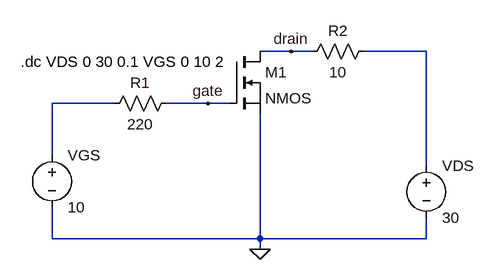
[diagram p0: schematic NMOS TRANSISTOR.asc]
NMOS TRANSISTOR.asc, the LTspice schematic file:
Version 4
SHEET 1 880 680
WIRE 320 16 272 16
WIRE 352 16 320 16
WIRE 528 16 432 16
WIRE 48 96 -48 96
WIRE 192 96 128 96
WIRE 224 96 192 96
WIRE -48 176 -48 96
WIRE 528 192 528 16
WIRE -48 304 -48 256
WIRE 272 304 272 112
WIRE 272 304 -48 304
WIRE 528 304 528 272
WIRE 528 304 272 304
WIRE 272 320 272 304
FLAG 272 320 0
FLAG 192 96 gate
FLAG 320 16 drain
SYMBOL voltage -48 160 R0
SYMATTR InstName VGS
SYMATTR Value 10
SYMBOL voltage 528 176 R0
SYMATTR InstName VDS
SYMATTR Value 30
SYMBOL res 144 80 R90
WINDOW 0 0 56 VBottom 2
WINDOW 3 32 56 VTop 2
SYMATTR InstName R1
SYMATTR Value 220
SYMBOL res 448 0 R90
WINDOW 0 0 56 VBottom 2
WINDOW 3 32 56 VTop 2
SYMATTR InstName R2
SYMATTR Value 10
SYMBOL nmos 224 16 R0
SYMATTR InstName M1
TEXT -96 32 Left 2 !.dc VDS 0 30 0.1 VGS 0 10 2

The netlist it stands for:
* NMOS TRANSISTOR.asc
VGS N002 0 10
VDS N001 0 30
R1 gate N002 220
R2 N001 drain 10
M1 drain gate 0 0 NMOS
.model NMOS NMOS
.model PMOS PMOS
.lib standard.mos
.dc VDS 0 30 0.1 VGS 0 10 2
.backanno
.end